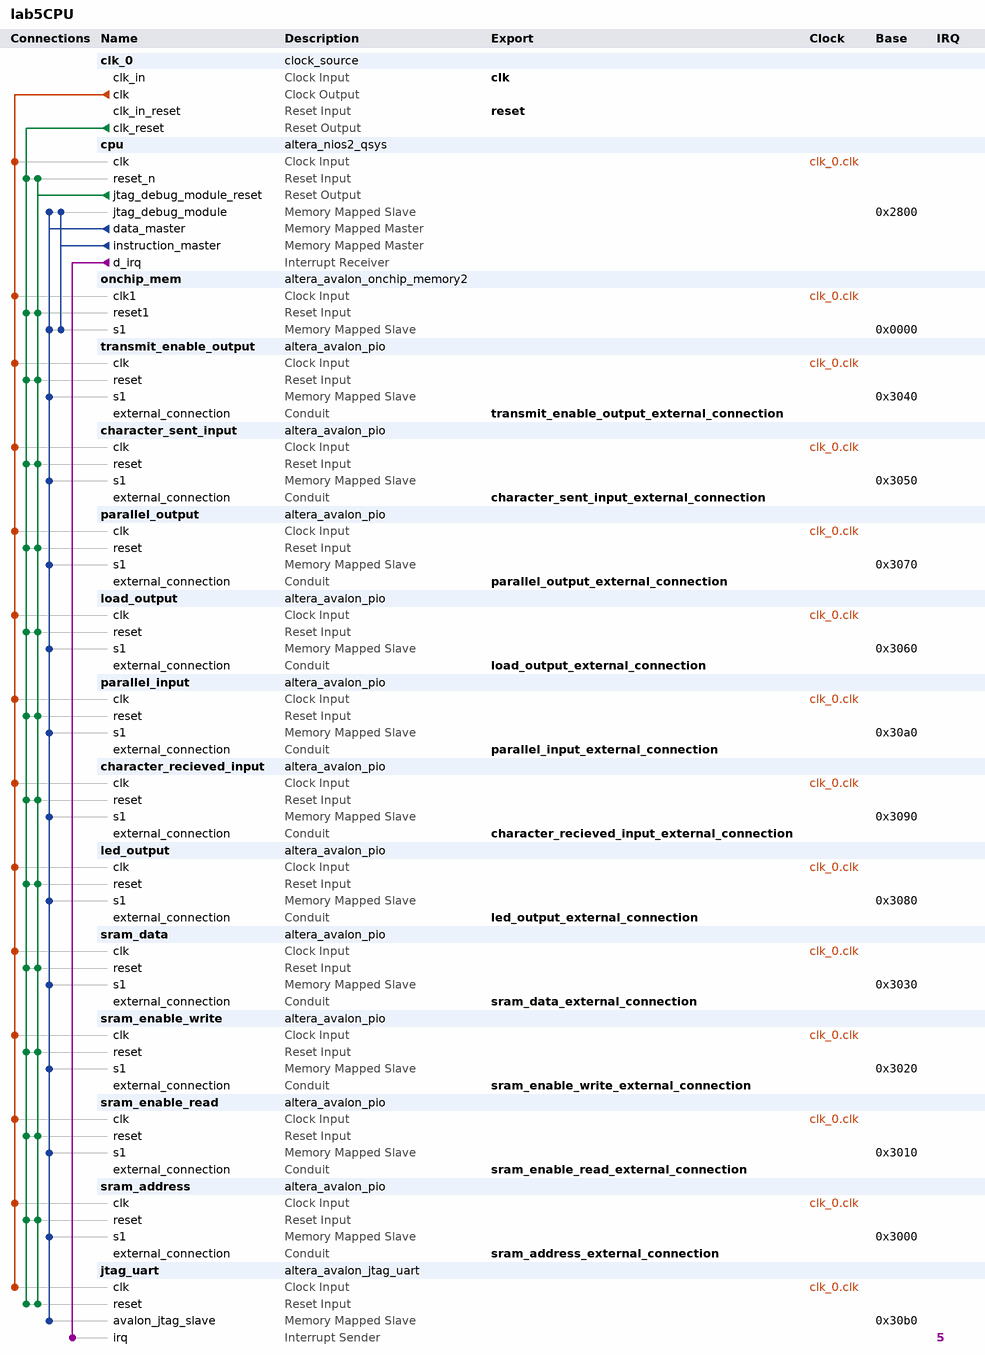
[diagram p0: system contents]
# Platform Designer (Qsys) system lab5CPU, Cyclone V 5CSEMA5F31C6
# Parameters at their usual value, and those the tool derives, are not listed.
package require -exact qsys 15.1
create_system lab5CPU
set_project_property DEVICE_FAMILY {Cyclone V}
set_project_property DEVICE 5CSEMA5F31C6

add_instance clk_0 clock_source 15.1
set_instance_parameter_value clk_0 clockFrequency 50000000

add_instance cpu altera_nios2_qsys 15.1
set_instance_parameter_value cpu breakSlave cpu.jtag_debug_module
set_instance_parameter_value cpu exceptionSlave onchip_mem.s1
set_instance_parameter_value cpu icache_size 2048
set_instance_parameter_value cpu impl Tiny
set_instance_parameter_value cpu mmu_TLBMissExcSlave None
set_instance_parameter_value cpu muldiv_multiplierType NoneSmall
set_instance_parameter_value cpu resetSlave onchip_mem.s1
set_instance_parameter_value cpu resetrequest_enabled true

add_instance onchip_mem altera_avalon_onchip_memory2 15.1
set_instance_parameter_value onchip_mem dataWidth 32
set_instance_parameter_value onchip_mem dualPort false
set_instance_parameter_value onchip_mem initMemContent true
set_instance_parameter_value onchip_mem initializationFileName onchip_mem.hex
set_instance_parameter_value onchip_mem memorySize 8192

add_instance transmit_enable_output altera_avalon_pio 15.1
set_instance_parameter_value transmit_enable_output direction Output
set_instance_parameter_value transmit_enable_output width 1

add_instance character_sent_input altera_avalon_pio 15.1
set_instance_parameter_value character_sent_input direction Input
set_instance_parameter_value character_sent_input width 1

add_instance parallel_output altera_avalon_pio 15.1
set_instance_parameter_value parallel_output direction Output
set_instance_parameter_value parallel_output width 8

add_instance load_output altera_avalon_pio 15.1
set_instance_parameter_value load_output direction Output
set_instance_parameter_value load_output width 1

add_instance parallel_input altera_avalon_pio 15.1
set_instance_parameter_value parallel_input direction Input
set_instance_parameter_value parallel_input width 8

add_instance character_recieved_input altera_avalon_pio 15.1
set_instance_parameter_value character_recieved_input direction Input
set_instance_parameter_value character_recieved_input width 1

add_instance led_output altera_avalon_pio 15.1
set_instance_parameter_value led_output direction Output
set_instance_parameter_value led_output width 8

add_instance sram_data altera_avalon_pio 15.1
set_instance_parameter_value sram_data direction Bidir
set_instance_parameter_value sram_data width 8

add_instance sram_enable_write altera_avalon_pio 15.1
set_instance_parameter_value sram_enable_write direction Output
set_instance_parameter_value sram_enable_write width 1

add_instance sram_enable_read altera_avalon_pio 15.1
set_instance_parameter_value sram_enable_read direction Output
set_instance_parameter_value sram_enable_read width 1

add_instance sram_address altera_avalon_pio 15.1
set_instance_parameter_value sram_address direction Output
set_instance_parameter_value sram_address width 11

add_instance jtag_uart altera_avalon_jtag_uart 15.1
set_instance_parameter_value jtag_uart simInteractiveOptions NO_INTERACTIVE_WINDOWS

# connections
add_connection clk_0.clk character_recieved_input.clk clock
add_connection clk_0.clk character_sent_input.clk clock
add_connection clk_0.clk cpu.clk clock
add_connection clk_0.clk jtag_uart.clk clock
add_connection clk_0.clk led_output.clk clock
add_connection clk_0.clk load_output.clk clock
add_connection clk_0.clk onchip_mem.clk1 clock
add_connection clk_0.clk parallel_input.clk clock
add_connection clk_0.clk parallel_output.clk clock
add_connection clk_0.clk sram_address.clk clock
add_connection clk_0.clk sram_data.clk clock
add_connection clk_0.clk sram_enable_read.clk clock
add_connection clk_0.clk sram_enable_write.clk clock
add_connection clk_0.clk transmit_enable_output.clk clock
add_connection clk_0.clk_reset character_recieved_input.reset reset
add_connection clk_0.clk_reset character_sent_input.reset reset
add_connection clk_0.clk_reset cpu.reset_n reset
add_connection clk_0.clk_reset jtag_uart.reset reset
add_connection clk_0.clk_reset led_output.reset reset
add_connection clk_0.clk_reset load_output.reset reset
add_connection clk_0.clk_reset onchip_mem.reset1 reset
add_connection clk_0.clk_reset parallel_input.reset reset
add_connection clk_0.clk_reset parallel_output.reset reset
add_connection clk_0.clk_reset sram_address.reset reset
add_connection clk_0.clk_reset sram_data.reset reset
add_connection clk_0.clk_reset sram_enable_read.reset reset
add_connection clk_0.clk_reset sram_enable_write.reset reset
add_connection clk_0.clk_reset transmit_enable_output.reset reset
add_connection cpu.jtag_debug_module_reset character_recieved_input.reset reset
add_connection cpu.jtag_debug_module_reset character_sent_input.reset reset
add_connection cpu.jtag_debug_module_reset cpu.reset_n reset
add_connection cpu.jtag_debug_module_reset jtag_uart.reset reset
add_connection cpu.jtag_debug_module_reset led_output.reset reset
add_connection cpu.jtag_debug_module_reset load_output.reset reset
add_connection cpu.jtag_debug_module_reset onchip_mem.reset1 reset
add_connection cpu.jtag_debug_module_reset parallel_input.reset reset
add_connection cpu.jtag_debug_module_reset parallel_output.reset reset
add_connection cpu.jtag_debug_module_reset sram_address.reset reset
add_connection cpu.jtag_debug_module_reset sram_data.reset reset
add_connection cpu.jtag_debug_module_reset sram_enable_read.reset reset
add_connection cpu.jtag_debug_module_reset sram_enable_write.reset reset
add_connection cpu.jtag_debug_module_reset transmit_enable_output.reset reset
add_connection cpu.data_master character_recieved_input.s1 avalon
set_connection_parameter_value cpu.data_master/character_recieved_input.s1 baseAddress 0x3090
add_connection cpu.data_master character_sent_input.s1 avalon
set_connection_parameter_value cpu.data_master/character_sent_input.s1 baseAddress 0x3050
add_connection cpu.data_master cpu.jtag_debug_module avalon
set_connection_parameter_value cpu.data_master/cpu.jtag_debug_module baseAddress 0x2800
add_connection cpu.data_master jtag_uart.avalon_jtag_slave avalon
set_connection_parameter_value cpu.data_master/jtag_uart.avalon_jtag_slave baseAddress 0x30b0
add_connection cpu.data_master led_output.s1 avalon
set_connection_parameter_value cpu.data_master/led_output.s1 baseAddress 0x3080
add_connection cpu.data_master load_output.s1 avalon
set_connection_parameter_value cpu.data_master/load_output.s1 baseAddress 0x3060
add_connection cpu.data_master onchip_mem.s1 avalon
set_connection_parameter_value cpu.data_master/onchip_mem.s1 baseAddress 0x0000
add_connection cpu.data_master parallel_input.s1 avalon
set_connection_parameter_value cpu.data_master/parallel_input.s1 baseAddress 0x30a0
add_connection cpu.data_master parallel_output.s1 avalon
set_connection_parameter_value cpu.data_master/parallel_output.s1 baseAddress 0x3070
add_connection cpu.data_master sram_address.s1 avalon
set_connection_parameter_value cpu.data_master/sram_address.s1 baseAddress 0x3000
add_connection cpu.data_master sram_data.s1 avalon
set_connection_parameter_value cpu.data_master/sram_data.s1 baseAddress 0x3030
add_connection cpu.data_master sram_enable_read.s1 avalon
set_connection_parameter_value cpu.data_master/sram_enable_read.s1 baseAddress 0x3010
add_connection cpu.data_master sram_enable_write.s1 avalon
set_connection_parameter_value cpu.data_master/sram_enable_write.s1 baseAddress 0x3020
add_connection cpu.data_master transmit_enable_output.s1 avalon
set_connection_parameter_value cpu.data_master/transmit_enable_output.s1 baseAddress 0x3040
add_connection cpu.instruction_master cpu.jtag_debug_module avalon
set_connection_parameter_value cpu.instruction_master/cpu.jtag_debug_module baseAddress 0x2800
add_connection cpu.instruction_master onchip_mem.s1 avalon
set_connection_parameter_value cpu.instruction_master/onchip_mem.s1 baseAddress 0x0000
add_connection cpu.d_irq jtag_uart.irq interrupt
set_connection_parameter_value cpu.d_irq/jtag_uart.irq irqNumber 5

# exported interfaces
add_interface character_recieved_input_external_connection conduit end
set_interface_property character_recieved_input_external_connection EXPORT_OF character_recieved_input.external_connection
add_interface character_sent_input_external_connection conduit end
set_interface_property character_sent_input_external_connection EXPORT_OF character_sent_input.external_connection
add_interface clk clock sink
set_interface_property clk EXPORT_OF clk_0.clk_in
add_interface led_output_external_connection conduit end
set_interface_property led_output_external_connection EXPORT_OF led_output.external_connection
add_interface load_output_external_connection conduit end
set_interface_property load_output_external_connection EXPORT_OF load_output.external_connection
add_interface parallel_input_external_connection conduit end
set_interface_property parallel_input_external_connection EXPORT_OF parallel_input.external_connection
add_interface parallel_output_external_connection conduit end
set_interface_property parallel_output_external_connection EXPORT_OF parallel_output.external_connection
add_interface reset reset sink
set_interface_property reset EXPORT_OF clk_0.clk_in_reset
add_interface sram_address_external_connection conduit end
set_interface_property sram_address_external_connection EXPORT_OF sram_address.external_connection
add_interface sram_data_external_connection conduit end
set_interface_property sram_data_external_connection EXPORT_OF sram_data.external_connection
add_interface sram_enable_read_external_connection conduit end
set_interface_property sram_enable_read_external_connection EXPORT_OF sram_enable_read.external_connection
add_interface sram_enable_write_external_connection conduit end
set_interface_property sram_enable_write_external_connection EXPORT_OF sram_enable_write.external_connection
add_interface transmit_enable_output_external_connection conduit end
set_interface_property transmit_enable_output_external_connection EXPORT_OF transmit_enable_output.external_connection

set_interconnect_requirement {$system} qsys_mm.clockCrossingAdapter HANDSHAKE
set_interconnect_requirement {$system} qsys_mm.insertDefaultSlave FALSE
set_interconnect_requirement {$system} qsys_mm.maxAdditionalLatency 1

save_system lab5CPU.qsys
